# EAGLE design Fejlesztokeszlet (EAGLE 6.0)
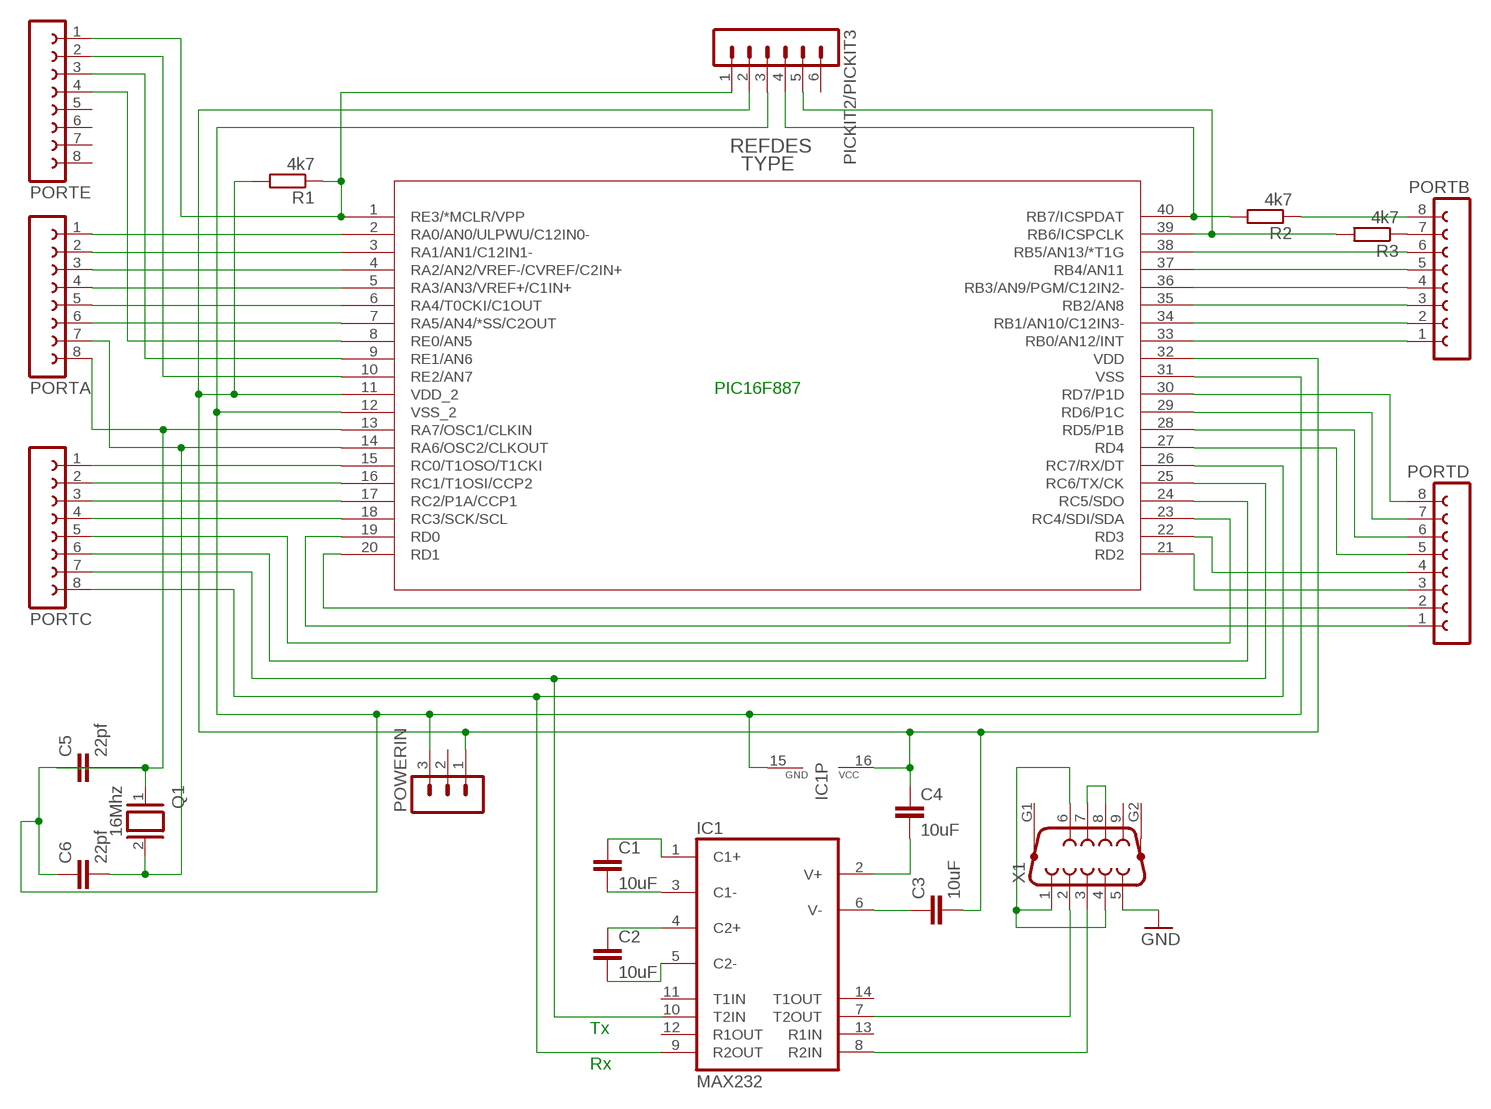
[diagram p0: schematic, sheet 1]

## Parts
C1  10uF  C5/3.5  [C5B3.5]
C2  10uF  C5/3.5  [C5B3.5]
C3  10uF  C5/3.5  [C5B3.5]
C4  10uF  C5/3.5  [C5B3.5]
C5  22pf  C7.5/3  [C7.5B3]
C6  22pf  C7.5/3  [C7.5B3]
IC1  MAX232  [DIL16]
PIC16F887  PIC16F887-X/P  [PDIP40_600MC]
PICKIT2/PICKIT3  MA06-1  [MA06-1]
PORTA  FE08-1  [FE08]
PORTB  FE08-1  [FE08]
PORTC  FE08-1  [FE08]
PORTD  FE08-1  [FE08]
PORTE  FE08-1  [FE08]
POWERIN  MA03-1  [MA03-1]
Q1  16Mhz  XTAL  [Q]
R1  4k7  R-EU_0204/7  [0204/7]
R2  4k7  R-EU_0204/7  [0204/7]
R3  4k7  R-EU_0204/7  [0204/7]
X1  F09HP  [F09HP]

## Nets
GND: X1.5
N$1: PIC16F887.2(RA0/AN0/ULPWU/C12IN0-) PORTA.1
N$2: PIC16F887.3(RA1/AN1/C12IN1-) PORTA.2
N$3: PIC16F887.4(RA2/AN2/VREF-/CVREF/C2IN+) PORTA.3
N$4: PIC16F887.5(RA3/AN3/VREF+/C1IN+) PORTA.4
N$5: PIC16F887.6(RA4/T0CKI/C1OUT) PORTA.5
N$6: PIC16F887.7(RA5/AN4/*SS/C2OUT) PORTA.6
N$7: C6.2 PIC16F887.14(RA6/OSC2/CLKOUT) PORTA.7 Q1.2
N$8: PIC16F887.13(RA7/OSC1/CLKIN) PORTA.8
N$9: PIC16F887.20(RD1) PORTD.2
N$10: PIC16F887.19(RD0) PORTD.1
N$11: PIC16F887.18(RC3/SCK/SCL) PORTC.4
N$12: PIC16F887.17(RC2/P1A/CCP1) PORTC.3
N$13: PIC16F887.16(RC1/T1OSI/CCP2) PORTC.2
N$14: PIC16F887.15(RC0/T1OSO/T1CKI) PORTC.1
N$15: PIC16F887.21(RD2) PORTD.3
N$16: PIC16F887.22(RD3) PORTD.4
N$17: PIC16F887.28(RD5/P1B) PORTD.6
N$18: PIC16F887.27(RD4) PORTD.5
N$19: PIC16F887.29(RD6/P1C) PORTD.7
N$20: PIC16F887.30(RD7/P1D) PORTD.8
N$21: PIC16F887.23(RC4/SDI/SDA) PORTC.5
N$22: PIC16F887.24(RC5/SDO) PORTC.6
N$23: IC1.10(T2IN) PIC16F887.25(RC6/TX/CK) PORTC.7
N$24: IC1.9(R2OUT) PIC16F887.26(RC7/RX/DT) PORTC.8
N$25: PIC16F887.33(RB0/AN12/INT) PORTB.1
N$26: PIC16F887.34(RB1/AN10/C12IN3-) PORTB.2
N$27: PIC16F887.35(RB2/AN8) PORTB.3
N$28: PIC16F887.36(RB3/AN9/PGM/C12IN2-) PORTB.4
N$29: PIC16F887.37(RB4/AN11) PORTB.5
N$30: PIC16F887.38(RB5/AN13/*T1G) PORTB.6
N$31: PIC16F887.39(RB6/ICSPCLK) PICKIT2/PICKIT3.5 R3.2
N$32: PIC16F887.40(RB7/ICSPDAT) PICKIT2/PICKIT3.4 R2.2
N$33: PIC16F887.8(RE0/AN5) PORTE.4
N$34: PIC16F887.9(RE1/AN6) PORTE.3
N$35: PIC16F887.10(RE2/AN7) PORTE.2
N$36: PIC16F887.1(RE3/*MCLR/VPP) PICKIT2/PICKIT3.1 PORTE.1 R1.1
N$37: C5.1 C6.1 IC1.15(GND) PIC16F887.12(VSS_2) PIC16F887.31(VSS) PICKIT2/PICKIT3.3 POWERIN.3
N$38: C2.2 IC1.5(C2-)
N$39: C1.1 IC1.1(C1+)
N$40: C1.2 IC1.3(C1-)
N$41: C2.1 IC1.4(C2+)
N$42: C3.2 C4.1 IC1.16(VCC) PIC16F887.11(VDD_2) PIC16F887.32(VDD) PICKIT2/PICKIT3.2 POWERIN.1 R1.2
N$43: C3.1 IC1.6(V-)
N$44: C4.2 IC1.2(V+)
N$45: C5.2 Q1.1
N$46: PORTB.8 R2.1
N$47: X1.1 X1.4 X1.6
N$48: X1.7 X1.8
N$49: IC1.8(R2IN) X1.3
N$50: IC1.7(T2OUT) X1.2
N$51: PORTB.7 R3.1
Unconnected: IC1.11(T1IN) IC1.12(R1OUT) IC1.13(R1IN) IC1.14(T1OUT) PICKIT2/PICKIT3.6 PORTE.5 PORTE.6 PORTE.7 PORTE.8 POWERIN.2 X1.9 X1.G1 X1.G2

## Notes on the sheet
- PIC16F887
- Tx
- Rx

## Library data of the parts
C1-C6 = capacitor-wima:C: CAPACITOR naming: grid - package width
IC1 = maxim:MAX232: RS232 TRANSEIVER; MF: MAXIM; MPN: MAX232ACPE+; OC_FARNELL: 9723773; OC_NEWARK: 68K4544
PIC16F887 = PIC16F887:PIC16F887-X/P
PICKIT2/PICKIT3 = con-lstb:MA06-1: PIN HEADER; OC_FARNELL: unknown; OC_NEWARK: unknown
PORTA PORTB PORTC PORTD PORTE = con-lsta:FE08-1: FEMALE HEADER; OC_FARNELL: unknown; OC_NEWARK: unknown
POWERIN = con-lstb:MA03-1: PIN HEADER; OC_FARNELL: unknown; OC_NEWARK: unknown
Q1 = special:XTAL: CRYSTAL
R1-R3 = resistor:R-EU_: RESISTOR, European symbol
X1 = con-subd:F09HP: SUB-D; OC_FARNELL: unknown; OC_NEWARK: unknown

## Board
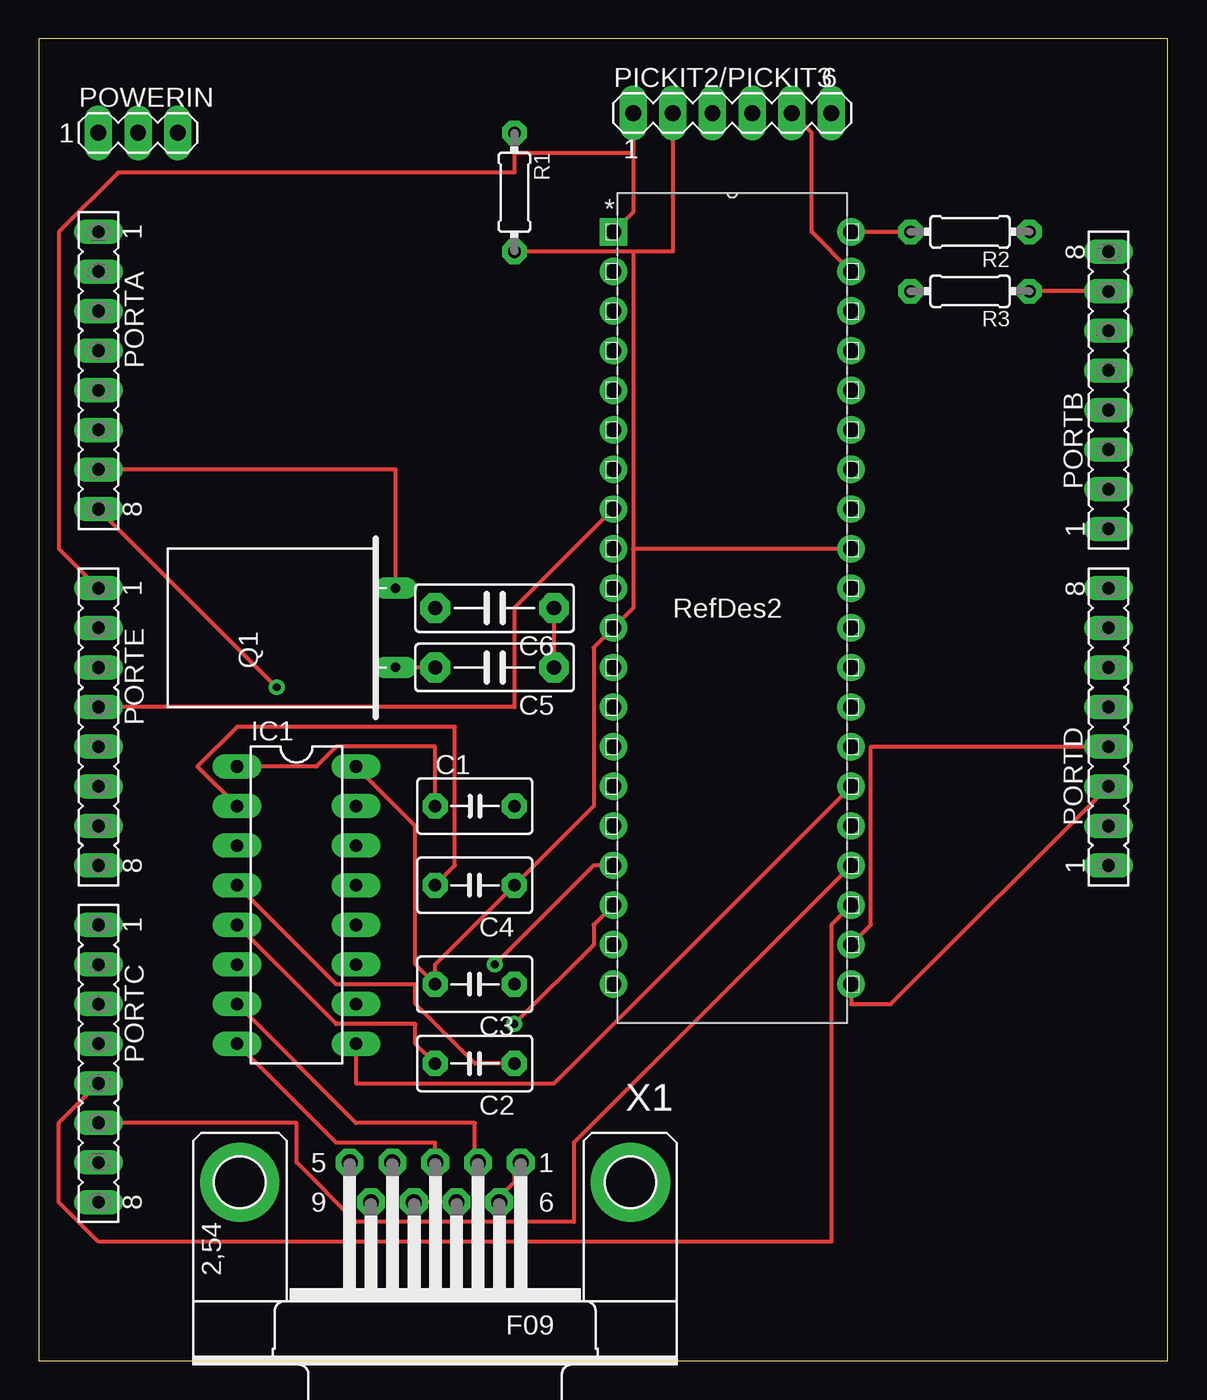
[diagram p1: board, top side]
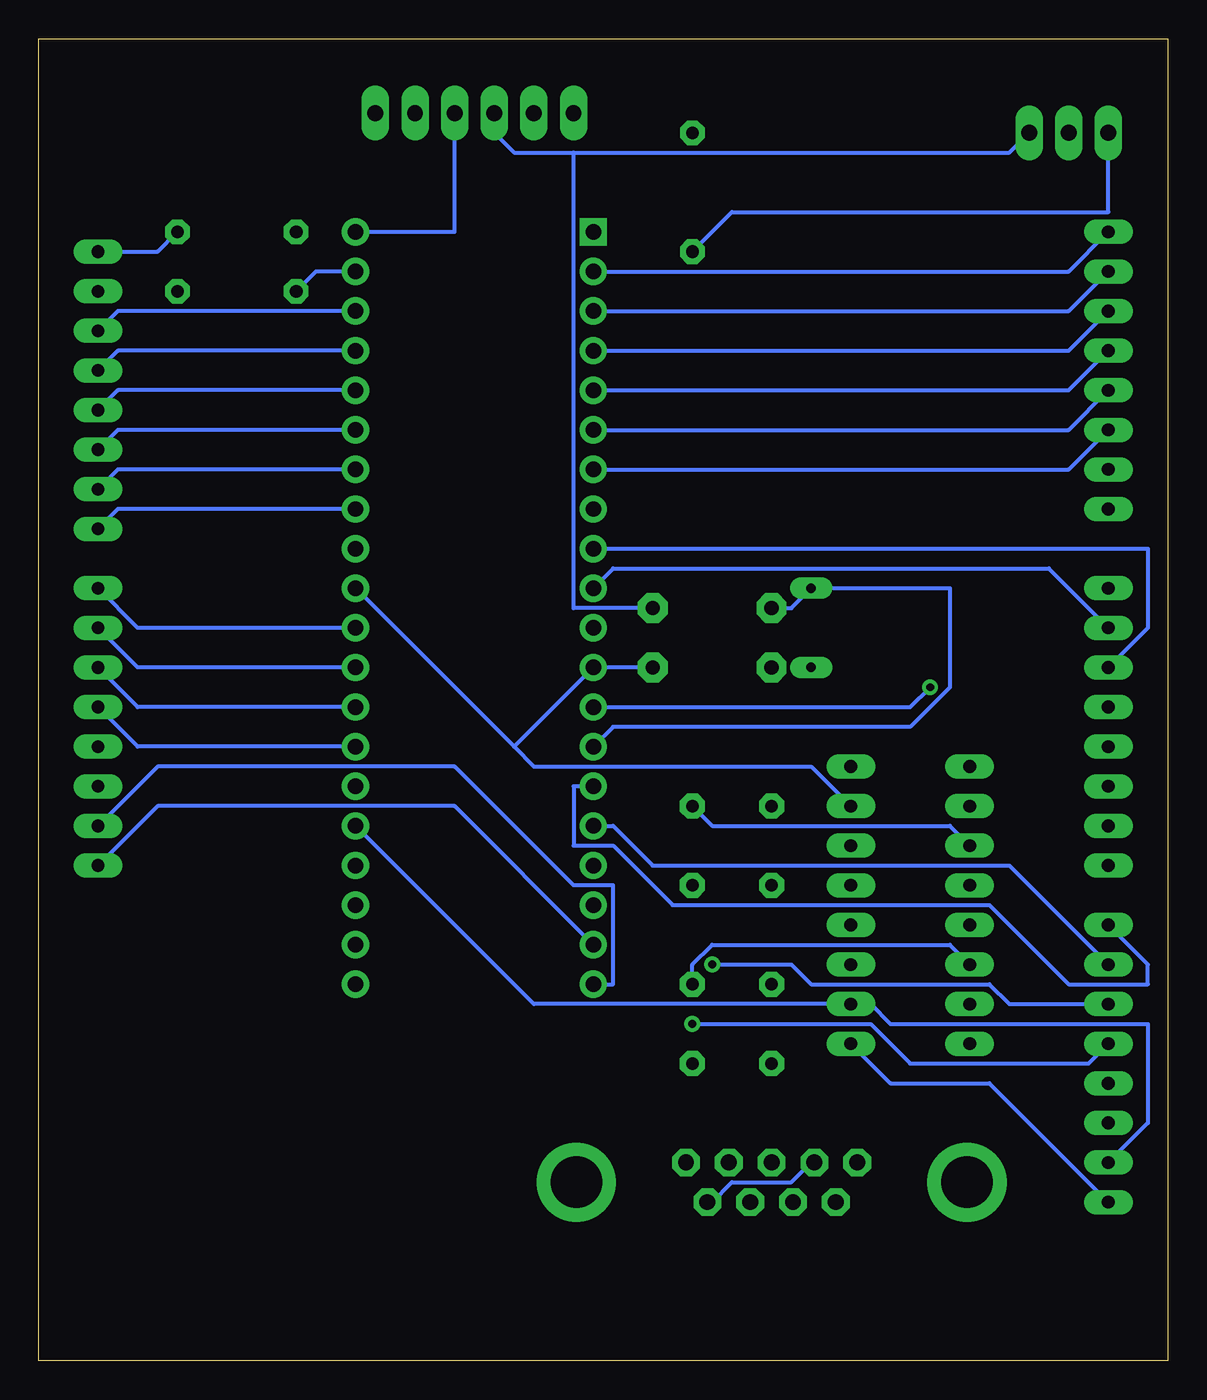
[diagram p2: board, bottom side, seen from below]

Size 72.37 x 84.76 mm. Coordinates in mm from the lower left corner, seen from the top.
Outline: 0,0 72.37,0 72.37,84.76 0,84.76 0,0
Copper layers (1*16): Top 0.035mm / dielectric 1.5mm / Bottom 0.035mm
Design rules: minimum track width 10mil, minimum drill 20mil, track to track 10mil, track to pad 10mil, pad to pad 10mil, via to via 10mil, smd to smd 10mil, copper to edge 40mil, drill to drill 10mil, minimum pad ring 15mil, minimum via ring 10mil, stop-mask expansion 0mil, vias tented up to drill 0mil, thermal gap 10mil

### Footprints (pad centres in the part's own frame; a part is rotated, then mirrored left to right if it is on the bottom)
C5B3.5 = drill 0.813 pad 1.6 octagon: 1 -2.54,0; 2 2.54,0
C7.5B3 = drill 0.914 pad 1.905 octagon: 1 -3.81,0; 2 3.81,0
DIL16 = drill 0.813 long: 1 -8.89,-3.81; 2 -6.35,-3.81; 3 -3.81,-3.81; 4 -1.27,-3.81; 5 1.27,-3.81; 6 3.81,-3.81; 7 6.35,-3.81; 8 8.89,-3.81; 9 8.89,3.81; 10 6.35,3.81; 11 3.81,3.81; 12 1.27,3.81; 13 -1.27,3.81; 14 -3.81,3.81; 15 -6.35,3.81; 16 -8.89,3.81
PDIP40_600MC = drill 0.991 square: 1 -15.24,48.26 | drill 0.991: 2 -15.24,45.72; 3 -15.24,43.18; 4 -15.24,40.64; 5 -15.24,38.1; 6 -15.24,35.56; 7 -15.24,33.02; 8 -15.24,30.48; 9 -15.24,27.94; 10 -15.24,25.4; 11 -15.24,22.86; 12 -15.24,20.32; 13 -15.24,17.78; 14 -15.24,15.24; 15 -15.24,12.7; 16 -15.24,10.16; 17 -15.24,7.62; 18 -15.24,5.08; 19 -15.24,2.54; 20 -15.24,0; 21 0,0; 22 0,2.54; 23 0,5.08; 24 0,7.62; 25 0,10.16; 26 0,12.7; 27 0,15.24; 28 0,17.78; 29 0,20.32; 30 0,22.86; 31 0,25.4; 32 0,27.94; 33 0,30.48; 34 0,33.02; 35 0,35.56; 36 0,38.1; 37 0,40.64; 38 0,43.18; 39 0,45.72; 40 0,48.26
MA06-1 = drill 1.016 long: 1 -6.35,0; 2 -3.81,0; 3 -1.27,0; 4 1.27,0; 5 3.81,0; 6 6.35,0
FE08 = drill 0.813 long: 1 -8.89,0; 2 -6.35,0; 3 -3.81,0; 4 -1.27,0; 5 1.27,0; 6 3.81,0; 7 6.35,0; 8 8.89,0
MA03-1 = drill 1.016 long: 1 -2.54,0; 2 0,0; 3 2.54,0
Q = drill 0.61 long: 1 -2.54,-7.62; 2 2.54,-7.62
0204/7 = drill 0.813 octagon: 1 -3.81,0; 2 3.81,0
F09HP = drill 1.016 octagon: 1 -5.486,-1.27; 2 -2.743,-1.27; 3 0,-1.27; 4 2.743,-1.27; 5 5.486,-1.27; 6 -4.115,1.27; 7 -1.372,1.27; 8 1.372,1.27; 9 4.115,1.27 | drill 3.302 pad 5.08: G1 -12.522,0; G2 12.522,0

### Placement (x,y rotation side)
C1  27.94,35.56 0 top
C2  27.94,19.05 180 top
C3  27.94,24.13 180 top
C4  27.94,30.48 180 top
C5  29.21,44.45 180 top
C6  29.21,48.26 180 top
IC1  16.51,29.21 270 top
PIC16F887  52.07,24.13 0 top
PICKIT2/PICKIT3  44.45,80.01 0 top
PORTA  3.81,63.5 270 top
PORTB  68.58,62.23 90 top
PORTC  3.81,19.05 270 top
PORTD  68.58,40.64 90 top
PORTE  3.81,40.64 270 top
POWERIN  6.35,78.74 0 top
Q1  15.24,46.99 90 top
R1  30.48,74.93 270 top
R2  59.69,72.39 180 top
R3  59.69,68.58 180 top
X1  25.4,11.43 180 top

### Tracks (layer width: path | path; a pad name or v marks a point on that pad's centre or on a via)
N$1
  Bottom 0.254: PORTA.1 6.35,69.85 PIC16F887.2
N$2
  Bottom 0.254: PORTA.2 6.35,67.31 PIC16F887.3
N$3
  Bottom 0.254: PORTA.3 6.35,64.77 PIC16F887.4
N$4
  Bottom 0.254: PORTA.4 6.35,62.23 PIC16F887.5
N$5
  Bottom 0.254: PORTA.5 6.35,59.69 PIC16F887.6
N$6
  Bottom 0.254: PORTA.6 6.35,57.15 PIC16F887.7
N$7
  Top 0.254: PORTA.7 22.86,57.15 Q1.2
  Bottom 0.254: C6.2 24.13,48.26 Q1.2 13.97,49.53 13.97,43.18 16.51,40.64 35.56,40.64 PIC16F887.14
N$8  (via drill 0.51)
  Top 0.254: v15.24,43.18 PORTA.8
  Bottom 0.254: v15.24,43.18 16.51,41.91 PIC16F887.13
N$9
  Bottom 0.254: PORTD.2 64.77,38.1 45.72,38.1 38.1,30.48 35.56,30.48 35.56,24.13 PIC16F887.20
N$10
  Bottom 0.254: PORTD.1 64.77,35.56 45.72,35.56 PIC16F887.19
N$11  (via drill 0.51)
  Top 0.254: v30.48,21.59 35.56,26.67 35.56,27.94 PIC16F887.18
  Bottom 0.254: PORTC.4 5.08,19.05 16.51,19.05 19.05,21.59 v30.48,21.59
N$12  (via drill 0.51)
  Top 0.254: v29.21,25.4 35.56,31.75 PIC16F887.17
  Bottom 0.254: PORTC.3 10.16,22.86 11.43,24.13 22.86,24.13 24.13,25.4 v29.21,25.4
N$13
  Bottom 0.254: PORTC.2 10.16,31.75 33.02,31.75 35.56,34.29 PIC16F887.16
N$14
  Bottom 0.254: PORTC.1 1.27,25.4 1.27,24.13 6.35,24.13 11.43,29.21 31.75,29.21 35.56,33.02 38.1,33.02 38.1,36.83 PIC16F887.15
N$15
  Top 0.254: PORTD.3 54.61,22.86 52.07,22.86 PIC16F887.21
N$16
  Top 0.254: PORTD.4 53.34,39.37 53.34,27.94 PIC16F887.22
N$17
  Bottom 0.254: PORTD.6 66.04,41.91 PIC16F887.28
N$18
  Bottom 0.254: PORTD.5 66.04,39.37 PIC16F887.27
N$19
  Bottom 0.254: PORTD.7 66.04,44.45 PIC16F887.29
N$20
  Bottom 0.254: PORTD.8 66.04,46.99 PIC16F887.30
N$21
  Top 0.254: PORTC.5 1.27,15.24 1.27,10.16 3.81,7.62 50.8,7.62 50.8,27.94 PIC16F887.23
N$22
  Top 0.254: PORTC.6 16.51,15.24 16.51,12.7 20.32,8.89 34.29,8.89 34.29,13.97 PIC16F887.24
N$23
  Bottom 0.254: PORTC.7 1.27,15.24 1.27,21.59 17.78,21.59 19.05,22.86 IC1.10 40.64,22.86 PIC16F887.25
N$24
  Top 0.254: PIC16F887.26 33.02,17.78 20.32,17.78 IC1.9
  Bottom 0.254: PORTC.8 11.43,17.78 17.78,17.78 IC1.9
N$25
  Bottom 0.254: PORTB.1 67.31,54.61 PIC16F887.33
N$26
  Bottom 0.254: PORTB.2 67.31,57.15 PIC16F887.34
N$27
  Bottom 0.254: PORTB.3 67.31,59.69 PIC16F887.35
N$28
  Bottom 0.254: PORTB.4 67.31,62.23 PIC16F887.36
N$29
  Bottom 0.254: PORTB.5 67.31,64.77 PIC16F887.37
N$30
  Bottom 0.254: PORTB.6 67.31,67.31 PIC16F887.38
N$31
  Top 0.254: PICKIT2/PICKIT3.5 49.53,78.74 49.53,72.39 PIC16F887.39
  Bottom 0.254: R3.2 54.61,69.85 PIC16F887.39
N$32
  Top 0.254: PIC16F887.40 R2.2
  Bottom 0.254: PICKIT2/PICKIT3.4 45.72,72.39 PIC16F887.40
N$33
  Top 0.254: PORTE.4 30.48,41.91 30.48,48.26 PIC16F887.8
N$34
  Bottom 0.254: PORTE.3 1.27,46.99 1.27,52.07 PIC16F887.9
N$35
  Bottom 0.254: PORTE.2 7.62,50.8 35.56,50.8 PIC16F887.10
N$36
  Top 0.254: PIC16F887.1 38.1,73.66 38.1,77.47 | PICKIT2/PICKIT3.1 38.1,77.47 | PORTE.1 1.27,52.07 1.27,72.39 5.08,76.2 30.48,76.2 30.48,77.47 | R1.1 30.48,77.47 | 30.48,77.47 38.1,77.47
N$37
  Top 0.254: C5.1 C6.1
  Bottom 0.254: POWERIN.3 10.16,77.47 38.1,77.47 | 38.1,77.47 41.91,77.47 43.18,78.74 PICKIT2/PICKIT3.3 | C5.1 PIC16F887.12 41.91,39.37 | IC1.15 22.86,38.1 40.64,38.1 41.91,39.37 | PIC16F887.31 41.91,39.37 | 38.1,77.47 38.1,48.26 C6.1
N$38
  Top 0.254: IC1.5 19.05,21.59 24.13,21.59 24.13,20.32 C2.2
N$39
  Top 0.254: IC1.1 17.78,38.1 19.05,39.37 25.4,39.37 C1.1
N$40
  Bottom 0.254: IC1.3 13.97,34.29 29.21,34.29 C1.2
N$41
  Top 0.254: IC1.4 19.05,24.13 24.13,24.13 24.13,22.86 27.94,19.05 C2.1
N$42
  Top 0.254: IC1.16 24.13,34.29 24.13,25.4 C3.2 25.4,25.4 C4.1 35.56,35.56 35.56,45.72 PIC16F887.11 38.1,48.26 38.1,52.07 | 38.1,71.12 40.64,71.12 PICKIT2/PICKIT3.2 | 38.1,71.12 R1.2 | 38.1,71.12 38.1,52.07 | 38.1,52.07 PIC16F887.32
  Bottom 0.254: POWERIN.1 3.81,73.66 27.94,73.66 R1.2
N$43
  Bottom 0.254: IC1.6 13.97,26.67 29.21,26.67 30.48,25.4 C3.1
N$44
  Top 0.254: IC1.2 10.16,38.1 12.7,40.64 26.67,40.64 26.67,31.75 C4.2
N$45
  Top 0.254: C5.2 Q1.1
N$46
  Bottom 0.254: R2.1 64.77,71.12 PORTB.8
N$47
  Top 0.254: X1.6 29.21,10.16 30.48,11.43 30.48,12.7 X1.1
  Bottom 0.254: X1.4 22.86,12.7 24.13,11.43 27.94,11.43 29.21,10.16 X1.6
N$48
  Top 0.254: X1.7 X1.8
N$49
  Top 0.254: IC1.8 19.05,13.97 25.4,13.97 X1.3
N$50
  Top 0.254: IC1.7 20.32,15.24 27.94,15.24 27.94,12.7 X1.2
N$51
  Top 0.254: PORTB.7 R3.1